# EasyEDA schematic LinienRoboter_V2-1 copy.json
TITLE: Linien Roboter; REV: 2.0; Date: 2021-11-24; Sheet: 1/1; Company: WAGO
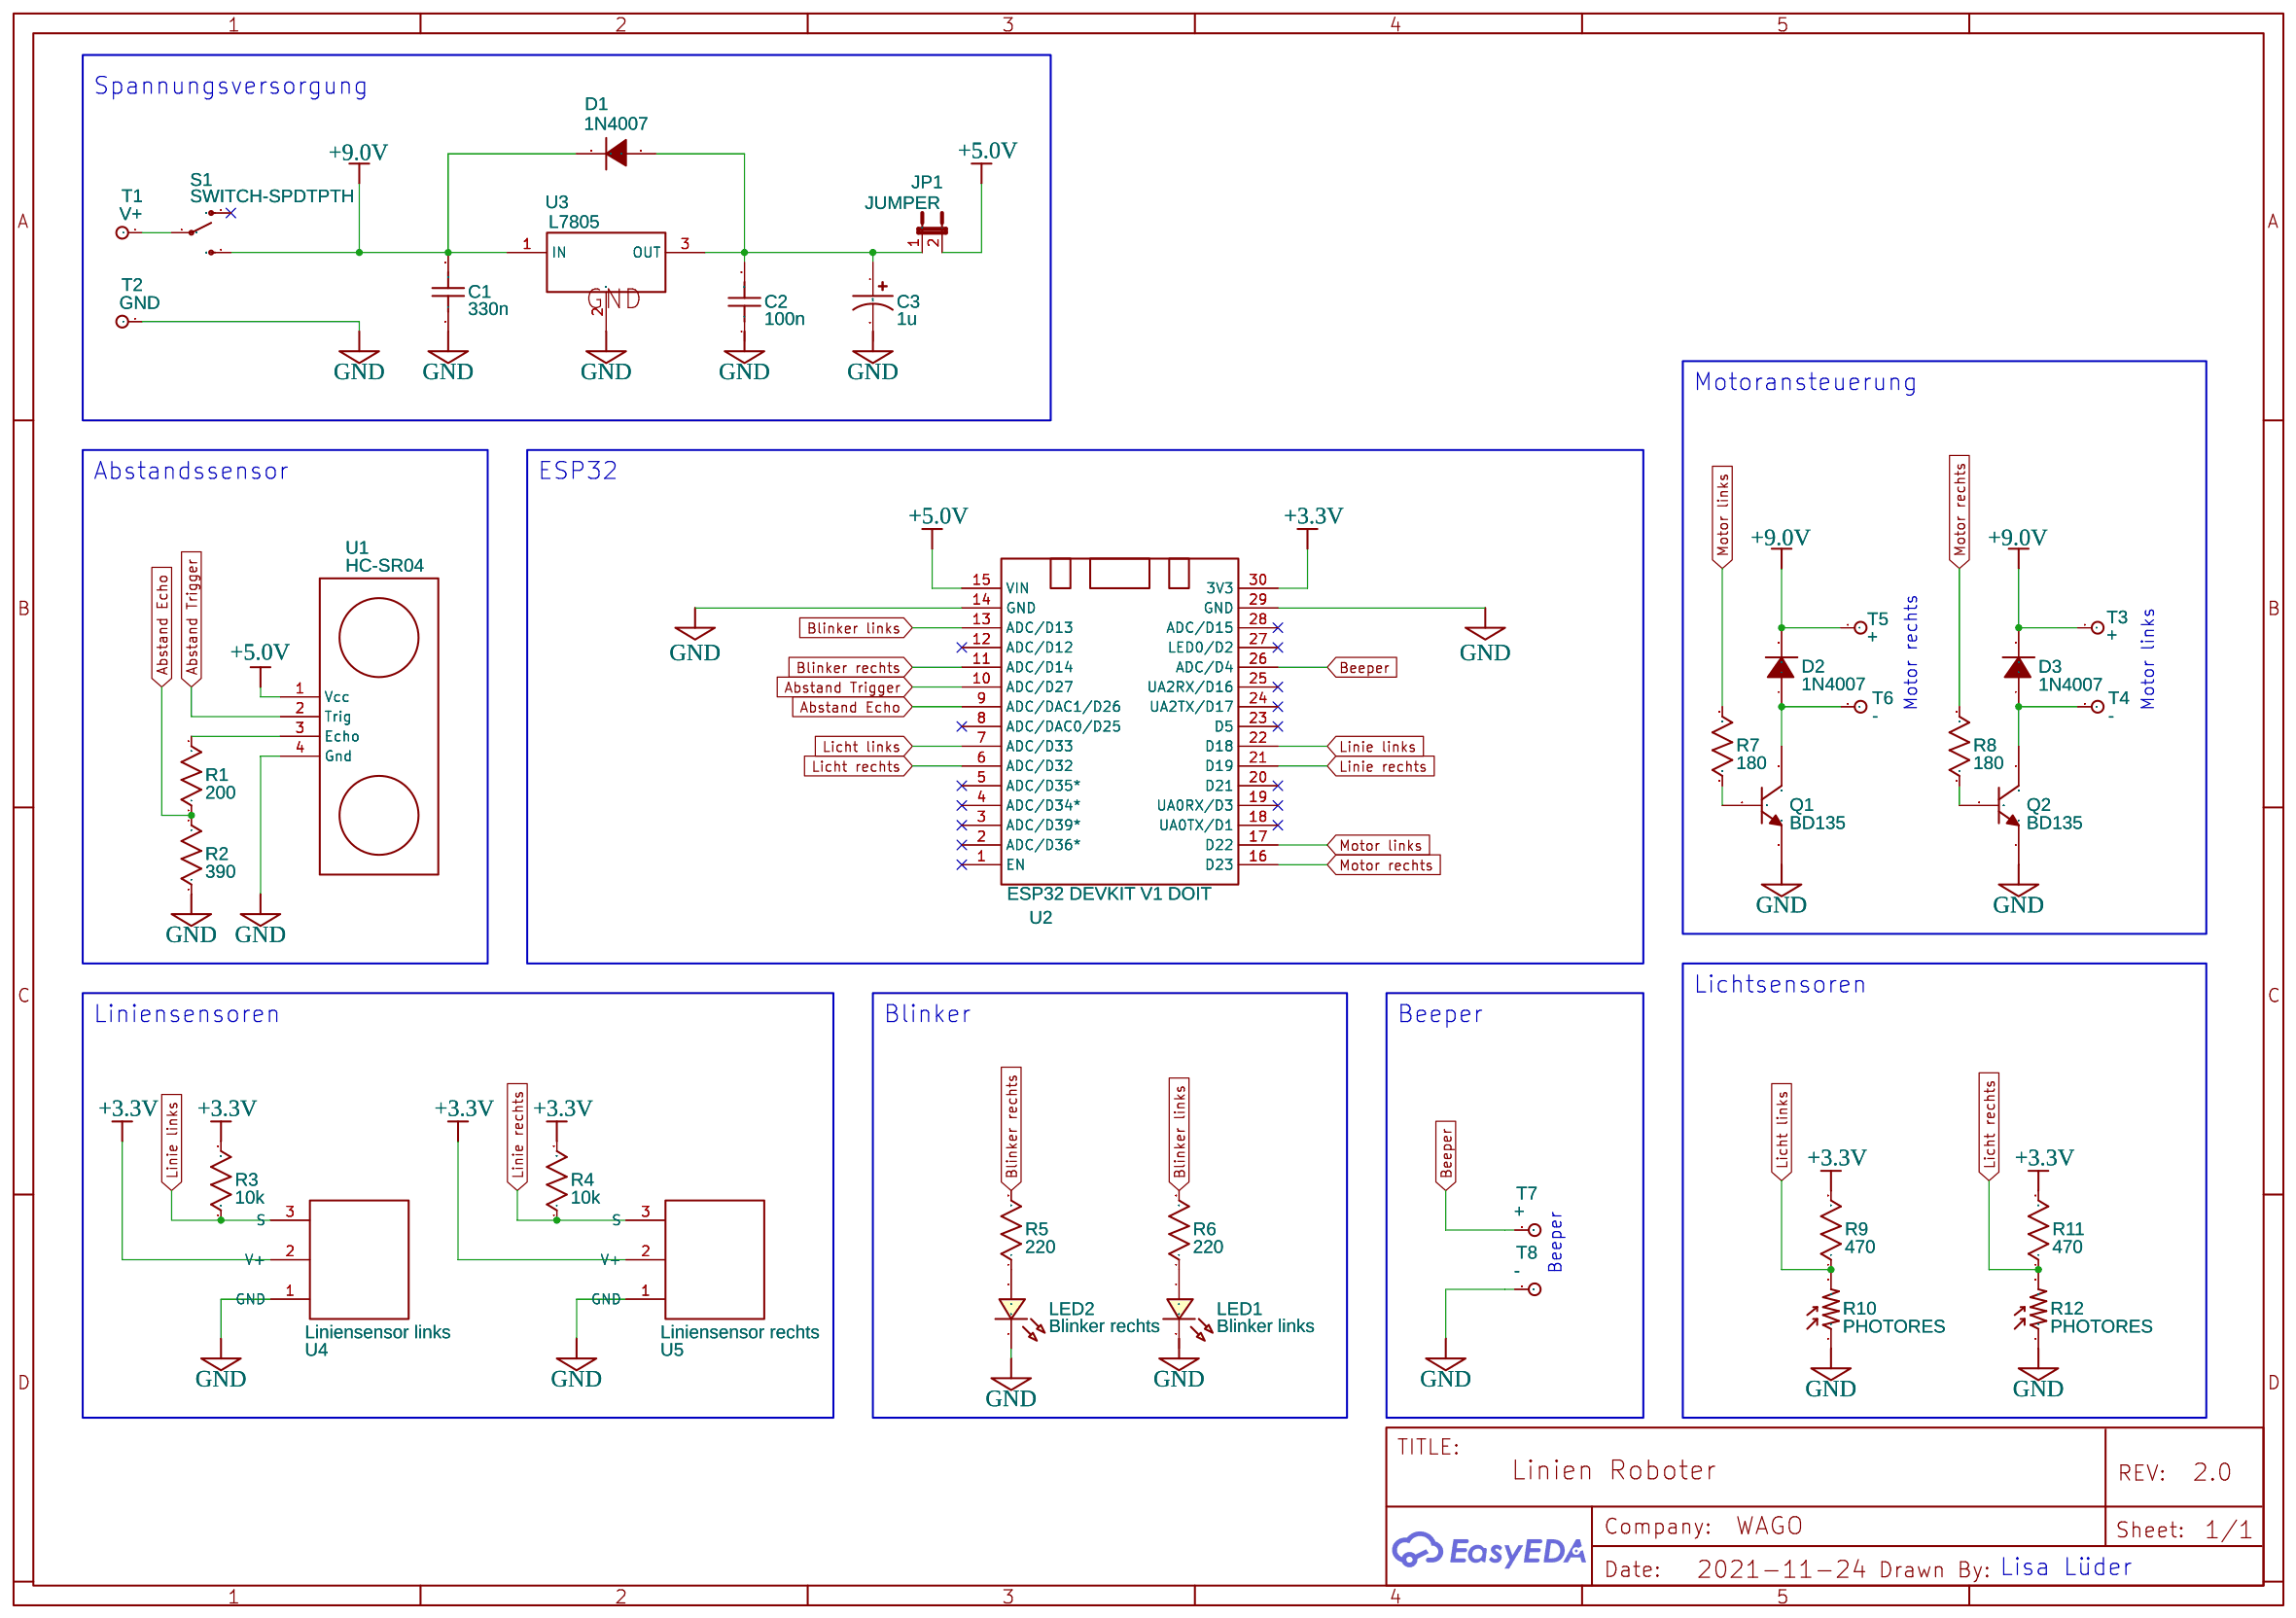
[diagram p0: schematic sheet]

## Parts
C1  330n  [RAD-0.1]
C2  100n  [RAD-0.1]
C3  1u  [CAP-D6.3×F2.5]
D1  1N4007  [DO-35_BD2.0-L4.0-P8.00-D0.5-FD]
D2  1N4007  [DO-35_BD2.0-L4.0-P8.00-D0.5-FD]
D3  1N4007  [DO-35_BD2.0-L4.0-P8.00-D0.5-FD]
JP1  JUMPER  [JUMPER 5]
LED1  Blinker links  [LED-TH_BD5.0_RED]
LED2  Blinker rechts  [LED-TH_BD5.0_RED]
Q1  BD135  [SOT-32_L7.6-W2.7-P2.15-L]
Q2  BD135  [SOT-32_L7.6-W2.7-P2.15-L]
R1  200  [R_AXIAL-0.4]
R2  390  [R_AXIAL-0.4]
R3  10k  [R_AXIAL-0.4]
R4  10k  [R_AXIAL-0.4]
R5  220  [R_AXIAL-0.4]
R6  220  [R_AXIAL-0.4]
R7  180  [R_AXIAL-0.4]
R8  180  [R_AXIAL-0.4]
R9  470  [R_AXIAL-0.4]
R10  PHOTORES  [PDV-P9XXX]
R11  470  [R_AXIAL-0.4]
R12  PHOTORES  [PDV-P9XXX]
S1  SWITCH-SPDTPTH  [SWITCH-SPDT]
T1  V+  [SOLDERPAD-PACKAGE]
T2  GND  [SOLDERPAD-PACKAGE]
T3  +  [SOLDERPAD-PACKAGE]
T4  -  [SOLDERPAD-PACKAGE]
T5  +  [SOLDERPAD-PACKAGE]
T6  -  [SOLDERPAD-PACKAGE]
T7  +  [SOLDERPAD-PACKAGE]
T8  -  [SOLDERPAD-PACKAGE]
U1  HC-SR04  [HC-SR04]
U2  ESP32 DEVKIT V1 DOIT  [DOIT-ESP32-DEVKIT-V1]
U3  L7805  [TO-220-3_L10.0-W4.5-P2.54-L]
U4  Liniensensor links  [LINIENSENSOR]
U5  Liniensensor rechts  [LINIENSENSOR]

## Library data of the parts
C1 C2 = C_RAD-0.1_US: Contributor: LCEDA_Lib
C3 = CE_TH_D6.3×F2.5_US: Contributor: LCEDA_Lib
D1-D3 = 1N4148: Supplier: LCSC; Manufacturer: SEMTECH; Supplier Part: C14516; JLCPCB Part Class: Extended Part
JP1 = JUMPER 2: Jumper 2 Pin; Contributor: PatternAgents
LED1 LED2 = LED-TH-5mm_R: Manufacturer: EVERLIGHT(台湾亿光); Manufacturer Part: 333-2SURD/S530-A3; Supplier Part: C87271; Supplier: LCSC; Contributor: LCEDA_Lib
Q1 Q2 = BD135: Supplier: LCSC; Supplier Part: C283398; Manufacturer: STMicroelectronics; Contributor: LCSC; JLCPCB Part Class: Extended Part
R1-R9 R11 = R_AXIAL-0.4_US: Contributor: LCEDA_Lib
R10 R12 = PHOTORESPDV-P9
S1 = SWITCH-SPDTPTH: SPDT Switch; Contributor: SparkFun
T1-T8 = PAD: Contributor: Niranjoy Y
U1 = HC-SR04: Contributor: Slowhand
U2 = ESP32 DEVKIT V1 DOIT: Contributor: ConceitoTeam
U3 = 7805(TO-220): Supplier: LCSC; Manufacturer: STMicroelectronics; Manufacturer Part: L7805CV-DG; Supplier Part: C3795; Contributor: LCEDA_Lib
U4 U5 = Liniensensor: Contributor: lisa_lue

## Nets
+3.3V: R3.2 R4.2 R9.2 R11.2 U2.30(3V3) U4.2(V+) U5.2(V+)
+5.0V: JP1.2(-) U1.1(Vcc) U2.15(VIN)
+9.0V: C1.2 D1.2(C) D2.2(C) D3.2(C) S1.3(S) T3.1 T5.1 U3.1(IN)
GND: C1.1 C2.1 C3.2 LED1.2 LED2.2 Q1.1(E) Q2.1(E) R2.1 R10.1 R12.1 T2.1 T8.1 U1.4(Gnd) U2.14(GND) U2.29(GND) U3.2(GND) U4.1(GND) U5.1(GND)
Abstand Echo: R1.1 R2.2 U2.9(ADC/DAC1/D26)
Abstand Trigger: U1.2(Trig) U2.10(ADC/D27)
Beeper: T7.1 U2.26(ADC/D4)
Blinker links: R6.2 U2.13(ADC/D13)
Blinker rechts: R5.2 U2.11(ADC/D14)
Licht links: R9.1 R10.2 U2.7(ADC/D33)
Licht rechts: R11.1 R12.2 U2.6(ADC/D32)
Linie links: R3.1 U2.22(D18) U4.3(S)
Linie rechts: R4.1 U2.21(D19) U5.3(S)
Motor links: R7.2 U2.17(D22)
Motor rechts: R8.2 U2.16(D23)
Net-(C2-2): C2.2 C3.1 D1.1(A) JP1.1(+) U3.3(OUT)
Net-(D2-1): D2.1(A) Q1.2(C) T6.1
Net-(D3-1): D3.1(A) Q2.2(C) T4.1
Net-(LED1-1): LED1.1 R6.1
Net-(LED2-1): LED2.1 R5.1
Net-(Q1-3): Q1.3(B) R7.1
Net-(Q2-3): Q2.3(B) R8.1
Net-(R1-2): R1.2 U1.3(Echo)
Net-(S1-2): S1.2(P) T1.1

Not connected (* = marked no-connect by the designer): S1 1(O)*; U2 1(EN)* 2(ADC/D36*)* 3(ADC/D39*)* 4(ADC/D34*)* 5(ADC/D35*)* 8(ADC/DAC0/D25)* 12(ADC/D12)* 18(UA0TX/D1)* 19(UA0RX/D3)* 20(D21)* 23(D5)* 24(UA2TX/D17)* 25(UA2RX/D16)* 27(LED0/D2)* 28(ADC/D15)*

## Notes on the sheet
- Spannungsversorgung
- Motoransteuerung
- Abstandssensor
- ESP32
- Motor rechts
- Motor links
- Lichtsensoren
- Liniensensoren
- Blinker
- Beeper
- Beeper
- Lisa Lüder
